# EAGLE design NDIR_SensorInterface (EAGLE 9.6.2)
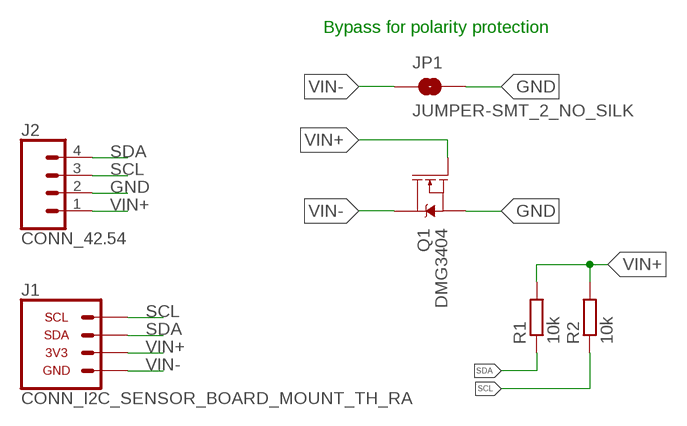
[diagram p0: schematic, sheet 1]

## Parts
J1  CONN_I2C_SENSOR_BOARD_MOUNT_TH_RA  [CONEC_43-01204]
J2  CONN_42.54  [1X04]
JP1  JUMPER-SMT_2_NO_SILK  [SMT-JUMPER_2_NO_SILK]
Q1  DMG3404  MOSFET-NCH-DMG3404L  [SOT23-3]
R1  10k  R-EU_10KR0603  [R0603]
R2  10k  R-EU_10KR0603  [R0603]

## Nets
GND: J2.2 JP1.2 Q1.2(S)
SCL: J1.3(SCL) J2.3 R2.1
SDA: J1.1(SDA) J2.4 R1.1
VIN+: J1.2(3V3) J2.1 Q1.1(G) R1.2 R2.2
VIN-: J1.4(GND) JP1.1 Q1.3(D)

## Notes on the sheet
- Bypass for polarity protection

## Library data of the parts
J1 = GEMS_Plugs:CONN_I2C_SENSOR: GEMS Connector for I2C Devices - Sensor Side; DIGIKEY: 626-2136-ND; MF: Conec; MPN: 43-01204
J2 = bschulz:CONN_4: Genaric 4 terminal header Digikey 2.54_SCREW <https://www.digikey.com/product-detail/en/on-shore-technology-inc/OSTVN04A150/ED10563-ND/1588864>; DIGIKEY: ED7564-04-ND; MF: Mill-Max; MPN: 800-10-004-10-002000
JP1 = bschulz:JUMPER-SMT_2_NO: Normally open jumper This jumper has two pads in close proximity to each other. Apply solder to close the connection. Round pads are easier to solder for beginners, but are a lot larger. SparkFun Product that uses the round pads: SparkFun EL Sequencer <https://www.sparkfun.com/products/12781>; DIGIKEY: DNP; MF: N/A; MPN: N/A
Q1 = bschulz:MOSFET-NCH: N-channel MOSFETs Voltage controlled devices that allow control of high current outputs. SparkFun Products: SparkFun OpenScale <https://www.sparkfun.com/products/13261> SparkFun Digital Sandbox <https://www.sparkfun.com/products/12651> SparkFun Monster Moto Shield <https://www.sparkfun.com/products/10182> SparkFun MOSFET Power Controller <https://www.sparkfun.com/products/11214>; DIGIKEY: DMG3404L-7DICT-ND; MF: Diodes Incorporated; MPN: DMG3404L-7
R1 R2 = bschulz_passives:R-EU_: RESISTOR, European symbol Digikey Parts: Yageo, 0402 <https://www.digikey.com/products/en/resistors/chip-resistor-surface-mount/52?k=&pkeyword=&sv=0&s=4356&sf=1&FV=-1%7C13%2C7%7C2%2C1291%7C39157%2C1989%7C0%2C-8%7C52%2C3%7C1131%2C3%7C2503&quantity=&ColumnSort=0&page=1&stock=1&pageSize=25> Yageo, 0603 <https://www.digikey.com/products/en/resistors/chip-resistor-surface-mount/52?k=&pkeyword=&sv=0&pv1291=39245&sf=1&FV=-5%7C4356%2C-5%7C47360%2C-8%7C52%2C-1%7C13%2C7%7C2%2C1989%7C0&quantity=10&ColumnSort=1000011&page=1&stock=1&pageSize=25> Panasonic, 0603 <https://www.digikey.com/products/en/resistors/chip-resistor-surface-mount/52?k=&pkeyword=&pv252=68&sf=0&FV=ffec373d%2C1c0002%2C142c040c%2C1f140000%2Cffe00034%2C80002%2Cc0001&quantity=&ColumnSort=0&page=1&stock=1&pageSize=25> Panasonic, precision, 0603 <https://www.digikey.com/products/en/resistors/chip-resistor-surface-mount/52?FV=ffec4907%2Cfffc000a%2Cc0172%2C142c040c%2C1f140000%2Cffe00034%2C1c0002&quantity=100&ColumnSort=2085&page=1&stock=1&pageSize=25> Panasonic, 0805 <https://www.digikey.com/products/en/resistors/chip-resistor-surface-mount/52?k=&pkeyword=&pv3=1&sf=0&FV=ffec373d%2C1c0002%2C1f140000%2Cffe00034%2C142c040d&quantity=&ColumnSort=0&page=1&stock=1&pageSize=25> Rohm, current sense <https://www.digikey.com/products/en/resistors/chip-resistor-surface-mount/52?k=&pkeyword=&pv3=1&sf=0&FV=ffecb688%2C1f140000%2Cffe00034%2C1c0002&quantity=&ColumnSort=0&page=1&stock=1&pageSize=25> Vishay, pulse proof automotive <https://www.digikey.com/products/en/resistors/chip-resistor-surface-mount/52?k=&pkeyword=&pv7=2&sf=0&FV=ffec5d6b%2Cffe00034%2C1f140000&quantity=&ColumnSort=0&page=1&stock=1&pageSize=25>; DIGIKEY: 311-10.0KHRCT-ND; MF: Yageo; MPN: RC0603FR-0710KL; VALUE_PART: 10k

## Board
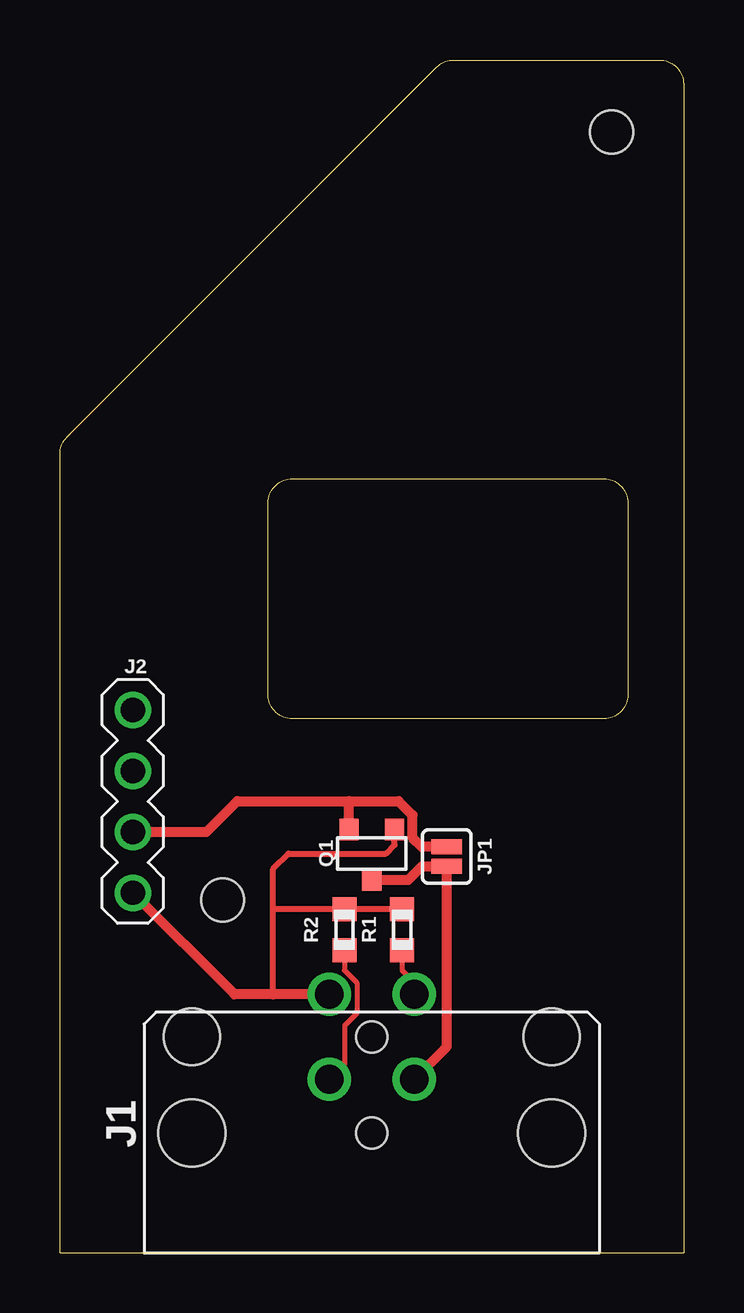
[diagram p1: board, top side]
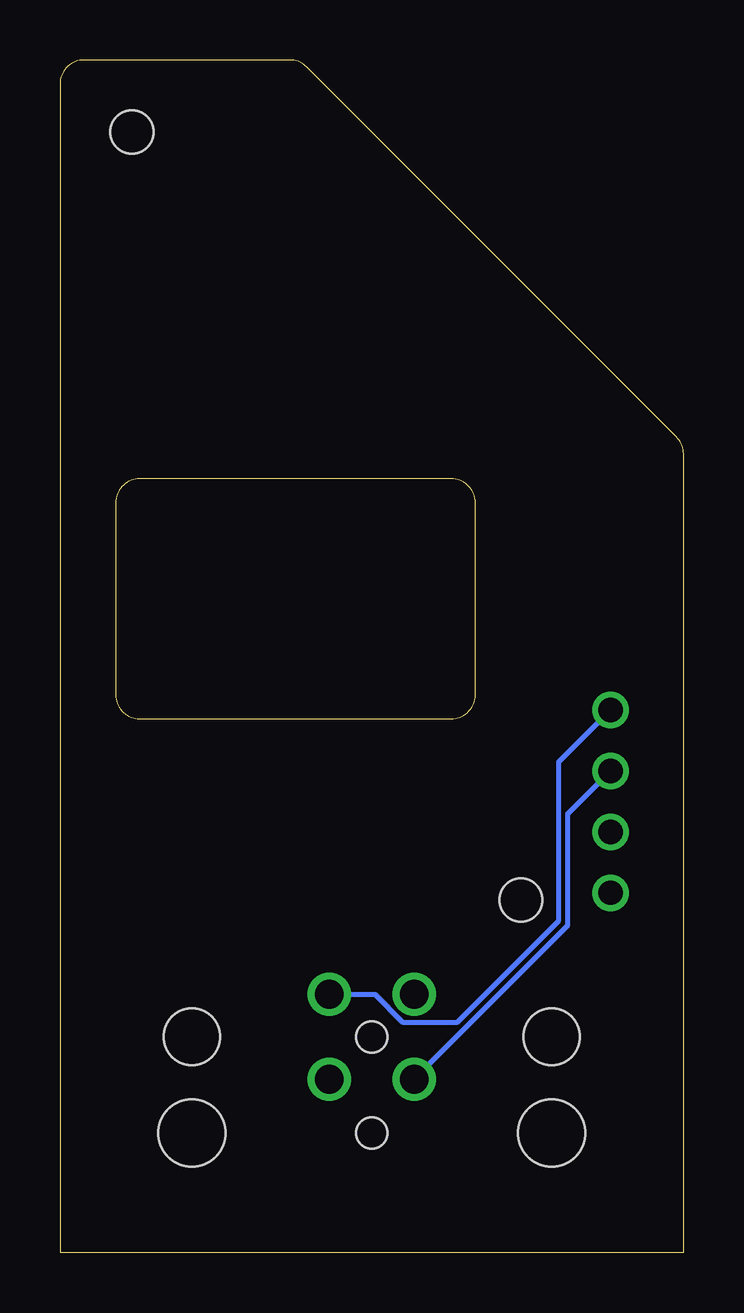
[diagram p2: board, bottom side, seen from below]

Size 26 x 49.7 mm. Coordinates in mm from the lower left corner, seen from the top.
Outline: 0,0 26,0 26,48.7 arc90 25,49.7 16.41,49.7 arc45 15.71,49.41 0.29,33.99 arc45 0,33.29 0,0
Outline: 22.68,22.25 9.68,22.25 arc-90 8.68,23.25 8.68,31.25 arc-90 9.68,32.25 22.68,32.25 arc-90 23.68,31.25 23.68,23.25 arc-90 22.68,22.25
Copper layers (1*16): Top 0.035559375mm / dielectric 1.6mm / Bottom 0.035559375mm
Design rules "oshpark-2layer": minimum track width 6mil, minimum drill 10mil, track to track 6mil, track to pad 6mil, pad to pad 6mil, via to via 6mil, smd to smd 6mil, copper to edge 15mil, drill to drill 6mil, minimum pad ring 5mil, minimum via ring 5mil, stop-mask expansion 2.5mil, vias tented up to drill 0mil, thermal gap 10mil
Holes 1.78 mm at 23,46.7 6.78,14.7

### Footprints (pad centres in the part's own frame; a part is rotated, then mirrored left to right if it is on the bottom)
CONEC_43-01204 = drill 1.2: 1 -1.768,-10.768; 2 1.768,-10.768; 3 1.768,-7.232; 4 -1.768,-7.232 | hole 2.8: -7.5,-5; 7.5,-5 | hole 2.35: -7.5,-9; 7.5,-9 | hole 1.3: 0,-5; 0,-9
1X04 = drill 1.016: 1 -3.81,0; 2 -1.27,0; 3 1.27,0; 4 3.81,0
SMT-JUMPER_2_NO_SILK = smd 0.635 x 1.27: 1 -0.406,0; 2 0.406,0
SOT23-3 = smd 0.8 x 0.9: 1 -0.95,-1; 2 0.95,-1; 3 0,1.1
R0603 = smd 1 x 1: 1 -0.85,0; 2 0.85,0

### Placement (x,y rotation side)
J1  13,0 180 top
J2  3.04,18.81 90 top
JP1  16.13,16.51 90 top
Q1  13,16.64 180 top
R1  14.27,13.46 90 top
R2  11.86,13.46 90 top

### Tracks (layer width: path | path; a pad name or v marks a point on that pad's centre or on a via)
GND
  Top 0.406: JP1.2 15.09,16.92 14.71,17.3 14.71,18.23 14.12,18.82 12.06,18.82 | J2.2 6.11,17.54 7.39,18.82 12.06,18.82 | Q1.2 12.05,18.81 12.06,18.82
SCL
  Top 0.2: R2.1 11.86,11.77 12.38,11.24 12.38,9.98 11.87,9.47 11.87,7.87 J1.3
  Bottom 0.2: J1.3 4.83,13.64 4.83,18.29 J2.3
SDA
  Top 0.2: R1.1 14.27,11.77 14.77,11.28 J1.1
  Bottom 0.2: J1.1 12.86,10.77 11.71,9.62 9.44,9.62 5.21,13.84 5.21,20.45 J2.4
VIN+
  Top 0.254: 8.89,10.77 8.89,14.35 | 8.89,14.35 8.89,16 9.53,16.64 13.59,16.64 13.95,17 Q1.1 | 8.89,14.35 8.93,14.31 R2.2 R1.2
  Top 0.406: J1.2 8.89,10.77 7.27,10.77 J2.1
VIN-
  Top 0.406: Q1.3 14.52,15.54 15.09,16.1 JP1.1 16.13,8.59 J1.4

### Text on the board
tDocu: Creature of Slime and Sludge / Spawned by Pollution's Poison / Threatens to Destroy the Earth!
bDocu: Project Hedorah / NDIR - SCD30 / v1.0